# EAGLE design QPD_breakout (EAGLE 6.5.0)
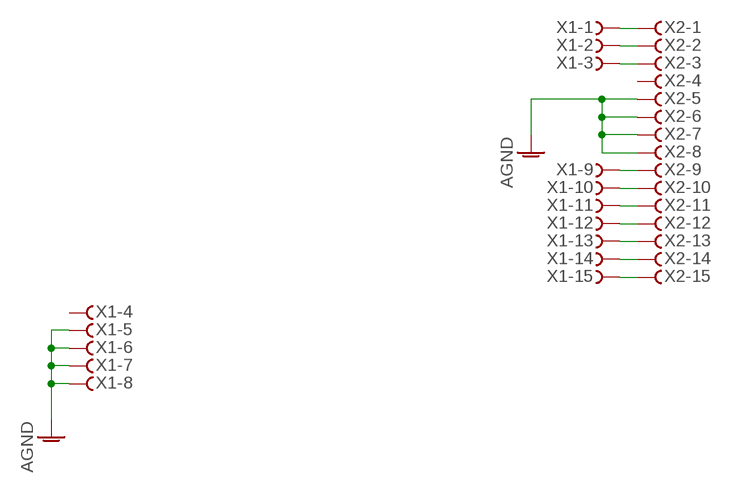
[diagram p0: schematic, sheet 1]

## Parts
X1  F15HDVS  [HDF15V]
X2  F15DS  [F15D]

## Nets
AGND: X1.5 X1.6 X1.7 X1.8 X2.5 X2.6 X2.7 X2.8
N$1: X1.1 X2.1
N$2: X1.9 X2.9
N$3: X1.10 X2.10
N$4: X1.11 X2.11
N$5: X1.12 X2.12
N$6: X1.2 X2.2
N$7: X1.3 X2.3
N$8: X1.13 X2.13
N$9: X1.14 X2.14
N$10: X1.15 X2.15
Unconnected: X1.4 X2.4

## Library data of the parts
X1 X2 = con-subd:F15?S: SUB-D; OC_FARNELL: unknown; OC_NEWARK: unknown

## Board
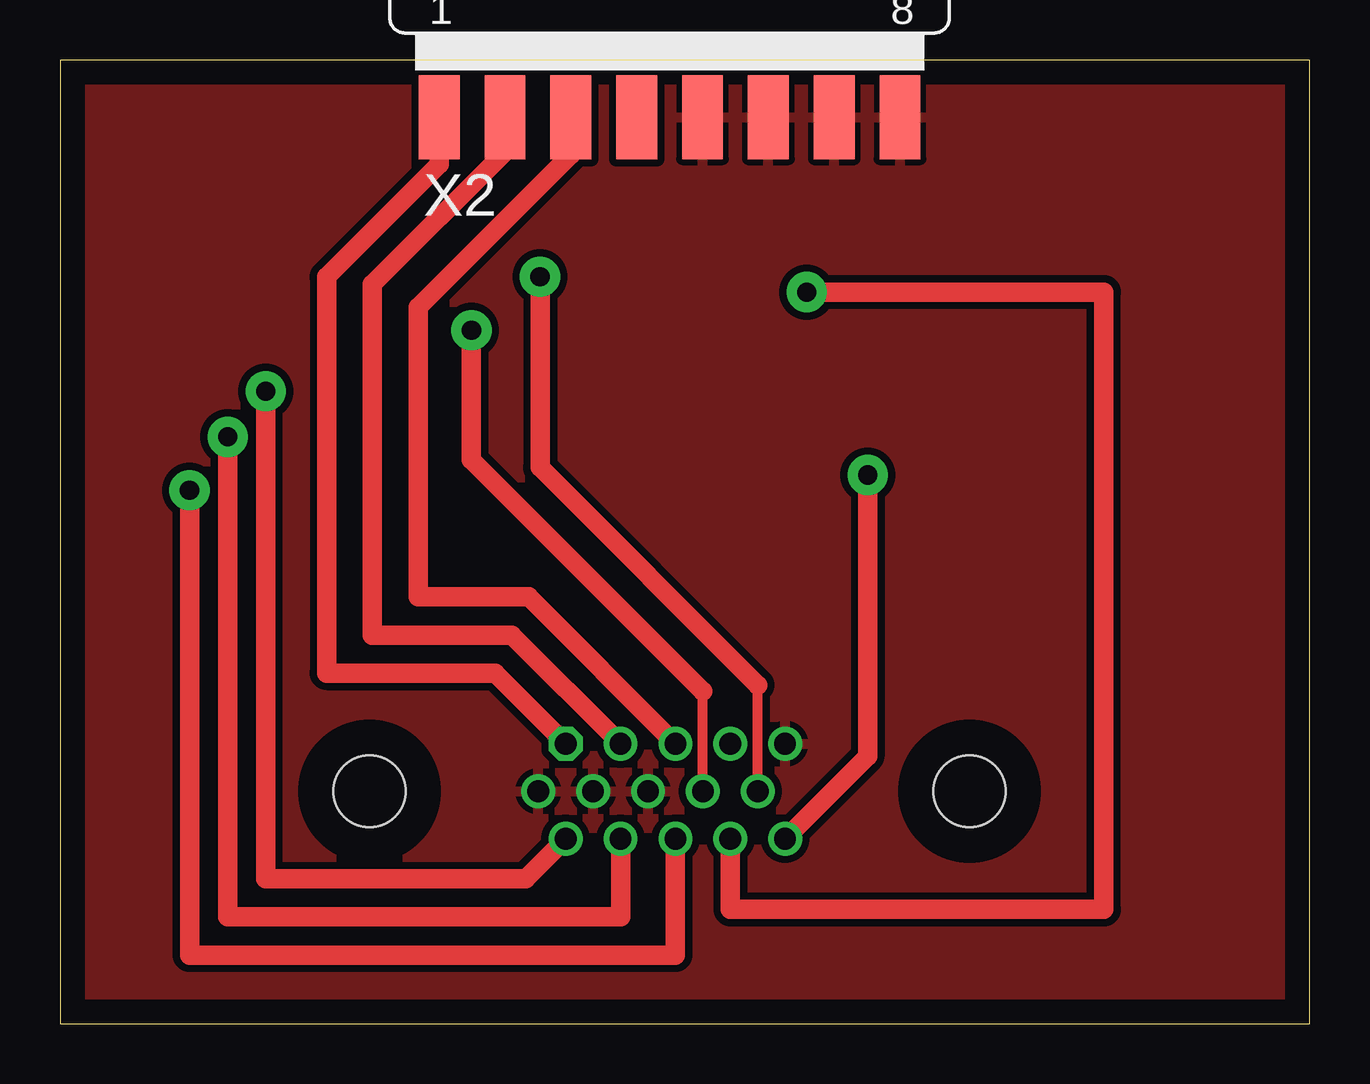
[diagram p1: board, top side]
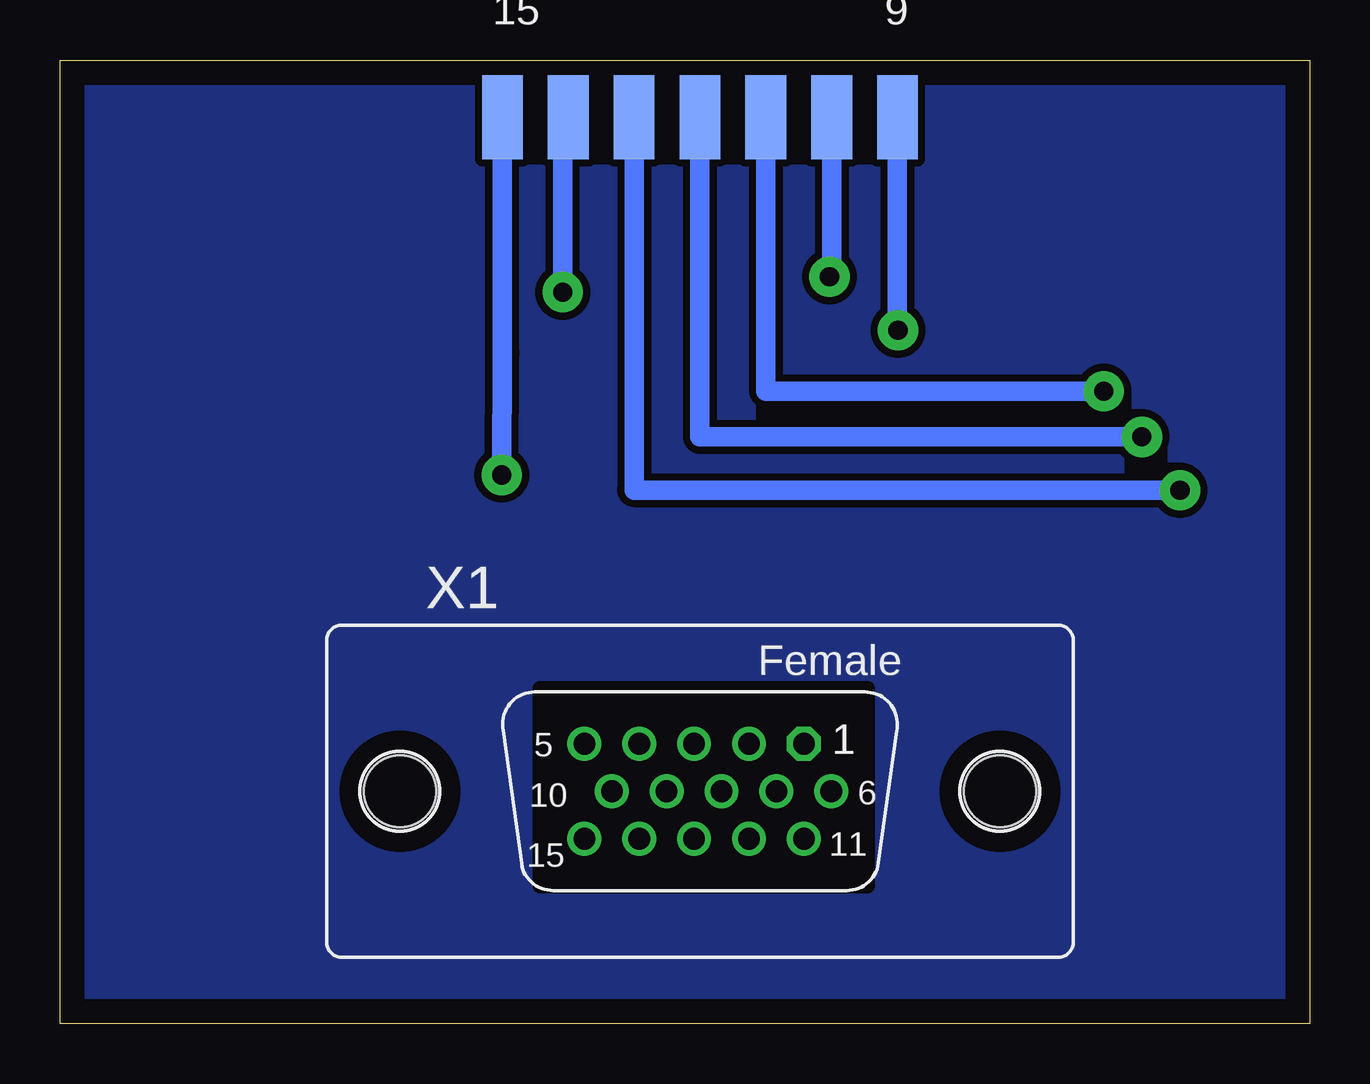
[diagram p2: board, bottom side, seen from below]

Size 52.06 x 40.15 mm. Coordinates in mm from the lower left corner, seen from the top.
Outline: 0,0 52.06,0 52.06,40.15 0,40.15 0,0
Copper layers (1*16): Top 0.035mm / dielectric 1.5mm / Bottom 0.035mm
Design rules "default": minimum track width 10mil, minimum drill 24mil, track to track 8mil, track to pad 8mil, pad to pad 8mil, via to via 8mil, smd to smd 8mil, copper to edge 40mil, drill to drill 8mil, minimum pad ring 10mil, minimum via ring 8mil, stop-mask expansion 4mil, vias tented up to drill 0mil, thermal gap 10mil
bRestrict: area 18.4,5.7 to 32.1,14

### Footprints (pad centres in the part's own frame; a part is rotated, then mirrored left to right if it is on the bottom)
HDF15V = drill 0.9 octagon: 1 4.329,1.98 | drill 0.9: 2 2.043,1.98; 3 -0.243,1.98; 4 -2.529,1.98; 5 -4.815,1.98; 6 5.472,0; 7 3.186,0; 8 0.9,0; 9 -1.386,0; 10 -3.672,0; 11 4.329,-1.98; 12 2.043,-1.98; 13 -0.243,-1.98; 14 -2.529,-1.98; 15 -4.815,-1.98 | hole 3: -12.5,0; 12.5,0
F15D = smd 1.7 x 3.5: 1 -9.601,-6.045; 2 -6.858,-6.045; 3 -4.115,-6.045; 4 -1.372,-6.045; 5 1.372,-6.045; 6 4.115,-6.045; 7 6.858,-6.045; 8 9.601,-6.045 | smd 1.7 x 3.5 bottom: 9 -8.23,-6.045; 10 -5.486,-6.045; 11 -2.743,-6.045; 12 0,-6.045; 13 2.743,-6.045; 14 5.486,-6.045; 15 8.23,-6.045

### Placement (x,y rotation side)
X1  25.4,9.68 0 bottom
X2  25.4,43.82 0 top

### Tracks (layer width: path | path; a pad name or v marks a point on that pad's centre or on a via)
AGND
  pour Top (isolate 0.305): 0,40.32 52.07,40.32 52.07,0 0,0
N$1
  Top 0.813: X2.1 15.8,35.8 11.11,31.11 11.11,14.61 18.13,14.61 X1.1
N$2  (via drill 0.8 pad 1.68)
  Top 0.406: X1.9 26.79,13.85
  Top 0.813: v17.14,28.89 17.14,23.5 26.79,13.85
  Bottom 0.813: X2.9 17.17,28.92 v17.14,28.89
N$3  (via drill 0.8 pad 1.68)
  Top 0.406: X1.10 29.07,14.11
  Top 0.813: v20,31.11 20,23.18 29.07,14.11
  Bottom 0.813: X2.10 19.91,31.2 v20,31.11
N$4  (via drill 0.8 pad 1.68)
  Top 0.813: v8.57,26.35 8.57,6.03 19.4,6.03 X1.11
  Bottom 0.813: X2.11 22.66,26.35 v8.57,26.35
N$5  (via drill 0.8 pad 1.68)
  Top 0.813: X1.12 23.36,4.45 6.99,4.45 v6.99,24.45
  Bottom 0.813: X2.12 25.4,24.45 v6.99,24.45
N$6
  Top 0.813: X2.2 18.54,36.32 13.02,30.8 13.02,16.19 18.83,16.19 X1.2
N$7
  Top 0.813: X2.3 21.29,36.21 14.92,29.84 14.92,17.78 19.53,17.78 X1.3
N$8  (via drill 0.8 pad 1.68)
  Top 0.813: X1.13 25.64,2.86 5.4,2.86 v5.4,22.22
  Bottom 0.813: X2.13 28.14,22.22 v5.4,22.22
N$9  (via drill 0.8 pad 1.68)
  Top 0.813: X1.14 27.93,4.76 43.5,4.76 43.5,30.48 v31.11,30.48
  Bottom 0.813: v31.11,30.48 31.11,37.77 X2.14
N$10  (via drill 0.8 pad 1.68)
  Top 0.813: v33.66,22.86 33.66,11.14 X1.15
  Bottom 0.813: v33.66,22.86 33.63,27.94 X2.15
N$11
  pour Bottom (isolate 0.305): 0,40.01 52.07,40.01 52.07,0 0,0